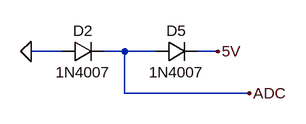
[diagram p0: schematic Draft8.asc]
Draft8.asc, the LTspice schematic file:
Version 4
SHEET 1 880 680
WIRE 112 160 64 160
WIRE 208 160 176 160
WIRE 256 160 208 160
WIRE 352 160 320 160
WIRE 208 224 208 160
WIRE 400 224 208 224
FLAG 352 160 5V
FLAG 64 160 0
FLAG 400 224 ADC
SYMBOL diode 112 176 R270
WINDOW 0 32 32 VTop 2
WINDOW 3 0 32 VBottom 2
SYMATTR InstName D2
SYMATTR Value 1N4007
SYMBOL diode 256 176 R270
WINDOW 0 32 32 VTop 2
WINDOW 3 0 32 VBottom 2
SYMATTR InstName D5
SYMATTR Value 1N4007

The netlist it stands for:
* Draft8.asc
D2 0 ADC 1N4007
D5 ADC 5V 1N4007
.model D D
.lib standard.dio
.backanno
.end